# EasyEDA schematic SCH_attempt2_2024-01-23.json
TITLE: Sheet_1; REV: 1.0; Date: 2024-01-10; Sheet: 1/1; Drawn By: masonlakis; Company: Your Company
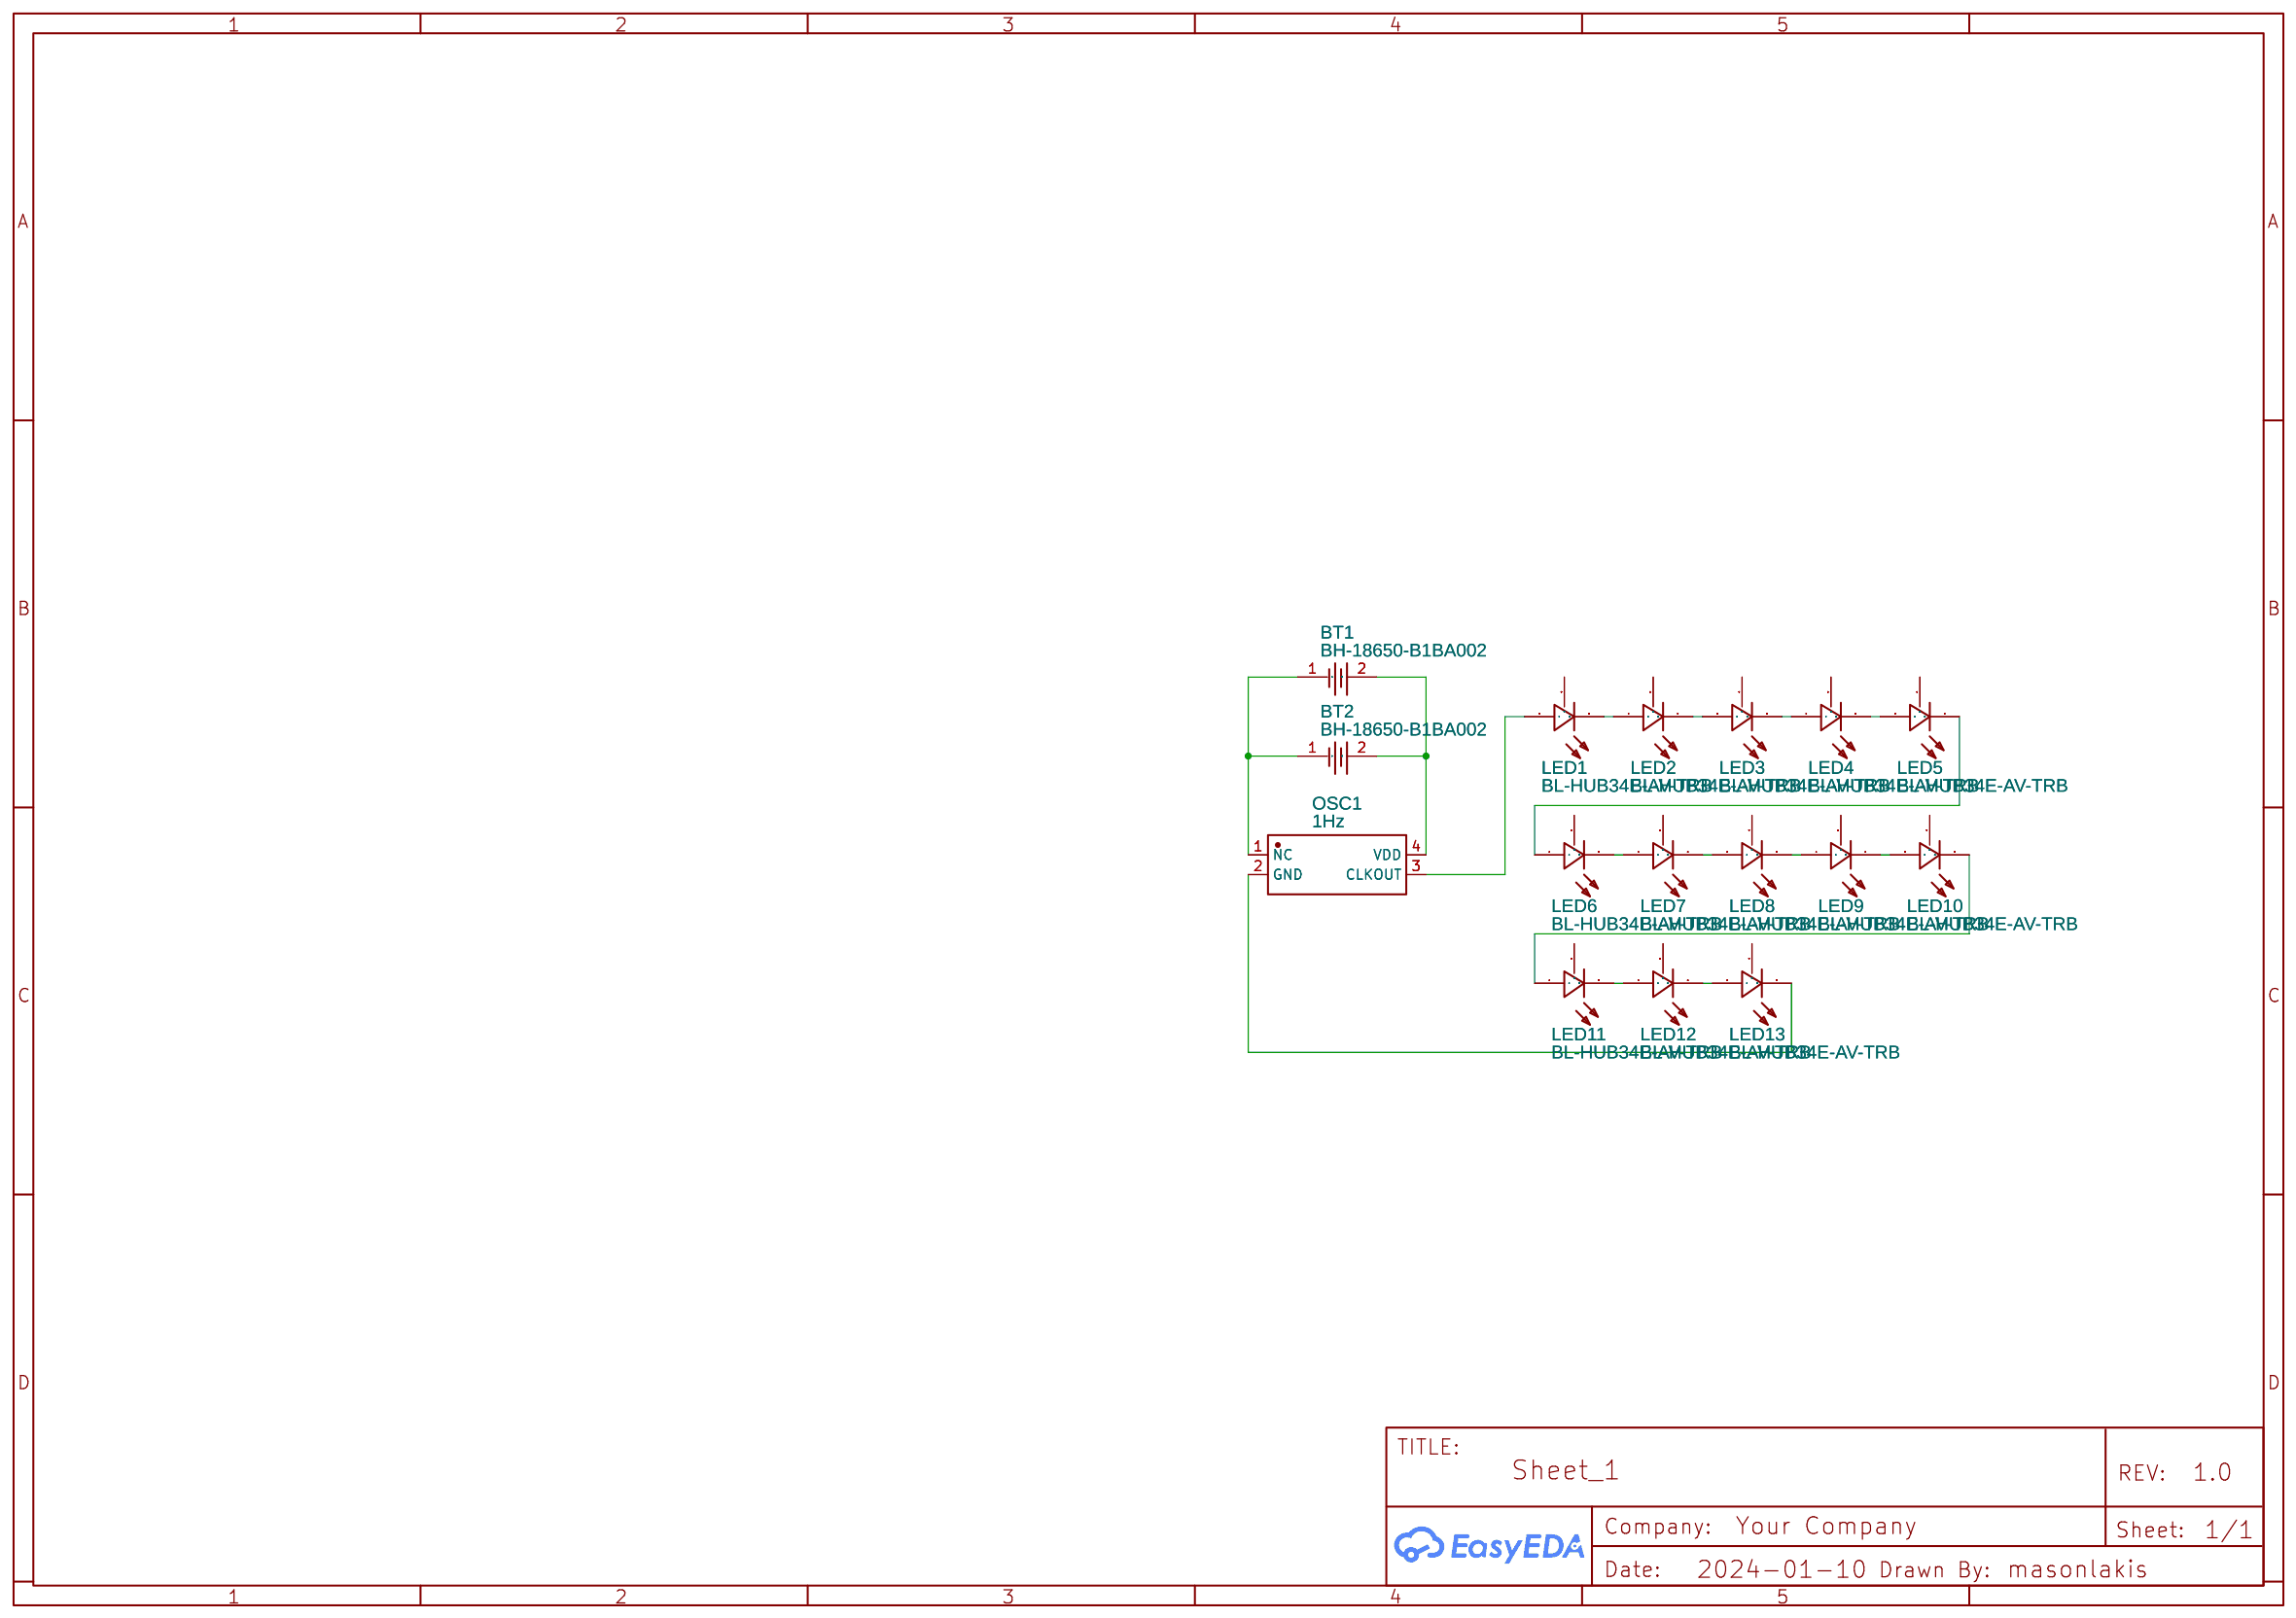
[diagram p0: schematic sheet]

## Parts
BT1  BH-18650-B1BA002  [BATTERY-SMD_18650-1S-L77.1-W20.7-1]
BT2  BH-18650-B1BA002  [BATTERY-SMD_18650-1S-L77.1-W20.7-1]
LED1  BL-HUB34E-AV-TRB  [LED-SMD_LED-BL-HUB34E-AV-TRB]
LED2  BL-HUB34E-AV-TRB  [LED-SMD_LED-BL-HUB34E-AV-TRB]
LED3  BL-HUB34E-AV-TRB  [LED-SMD_LED-BL-HUB34E-AV-TRB]
LED4  BL-HUB34E-AV-TRB  [LED-SMD_LED-BL-HUB34E-AV-TRB]
LED5  BL-HUB34E-AV-TRB  [LED-SMD_LED-BL-HUB34E-AV-TRB]
LED6  BL-HUB34E-AV-TRB  [LED-SMD_LED-BL-HUB34E-AV-TRB]
LED7  BL-HUB34E-AV-TRB  [LED-SMD_LED-BL-HUB34E-AV-TRB]
LED8  BL-HUB34E-AV-TRB  [LED-SMD_LED-BL-HUB34E-AV-TRB]
LED9  BL-HUB34E-AV-TRB  [LED-SMD_LED-BL-HUB34E-AV-TRB]
LED10  BL-HUB34E-AV-TRB  [LED-SMD_LED-BL-HUB34E-AV-TRB]
LED11  BL-HUB34E-AV-TRB  [LED-SMD_LED-BL-HUB34E-AV-TRB]
LED12  BL-HUB34E-AV-TRB  [LED-SMD_LED-BL-HUB34E-AV-TRB]
LED13  BL-HUB34E-AV-TRB  [LED-SMD_LED-BL-HUB34E-AV-TRB]
OSC1  1Hz  [OSC-SMD_4P-L2.0-W1.2-L-1]

## Library data of the parts
BT1 BT2 = BH-18650-B1BA002: Contributor: lcsc; Supplier: LCSC; Supplier Part: C2988620; Manufacturer: MYOUNG(美阳); JLCPCB Part Class: Extended Part
LED1-LED13 = BL-HUB34E-AV-TRB: Contributor: LCSC; Supplier: LCSC; Supplier Part: C183874; Manufacturer: BrtLed(佰鸿); JLCPCB Part Class: Extended Part
OSC1 = ASTMK-0.001KHZ-LQ-D14-H-T3: Contributor: lcsc; Supplier: LCSC; Supplier Part: C1995207; Manufacturer: ABRACON; JLCPCB Part Class: Extended Part

## Nets
Net-(BT1-1): BT1.1 BT2.1 OSC1.1(NC)
Net-(BT1-2): BT1.2 BT2.2 OSC1.4(VDD)
Net-(LED1-1): LED1.1(A) OSC1.3(CLKOUT)
Net-(LED1-2): LED1.2(C) LED2.1(A)
Net-(LED2-2): LED2.2(C) LED3.1(A)
Net-(LED3-2): LED3.2(C) LED4.1(A)
Net-(LED4-2): LED4.2(C) LED5.1(A)
Net-(LED5-2): LED5.2(C) LED6.1(A)
Net-(LED6-2): LED6.2(C) LED7.1(A)
Net-(LED7-2): LED7.2(C) LED8.1(A)
Net-(LED8-2): LED8.2(C) LED9.1(A)
Net-(LED9-2): LED9.2(C) LED10.1(A)
Net-(LED10-2): LED10.2(C) LED11.1(A)
Net-(LED11-2): LED11.2(C) LED12.1(A)
Net-(LED12-2): LED12.2(C) LED13.1(A)
Net-(LED13-2): LED13.2(C) OSC1.2(GND)

Not connected (* = marked no-connect by the designer): LED1 3; LED2 3; LED3 3; LED4 3; LED5 3; LED6 3; LED7 3; LED8 3; LED9 3; LED10 3; LED11 3; LED12 3; LED13 3
